# Altium schematic sheet driver_led.SchDoc
size A4; DocumentNumber: 2; SheetNumber: 2; SheetTotal: 3
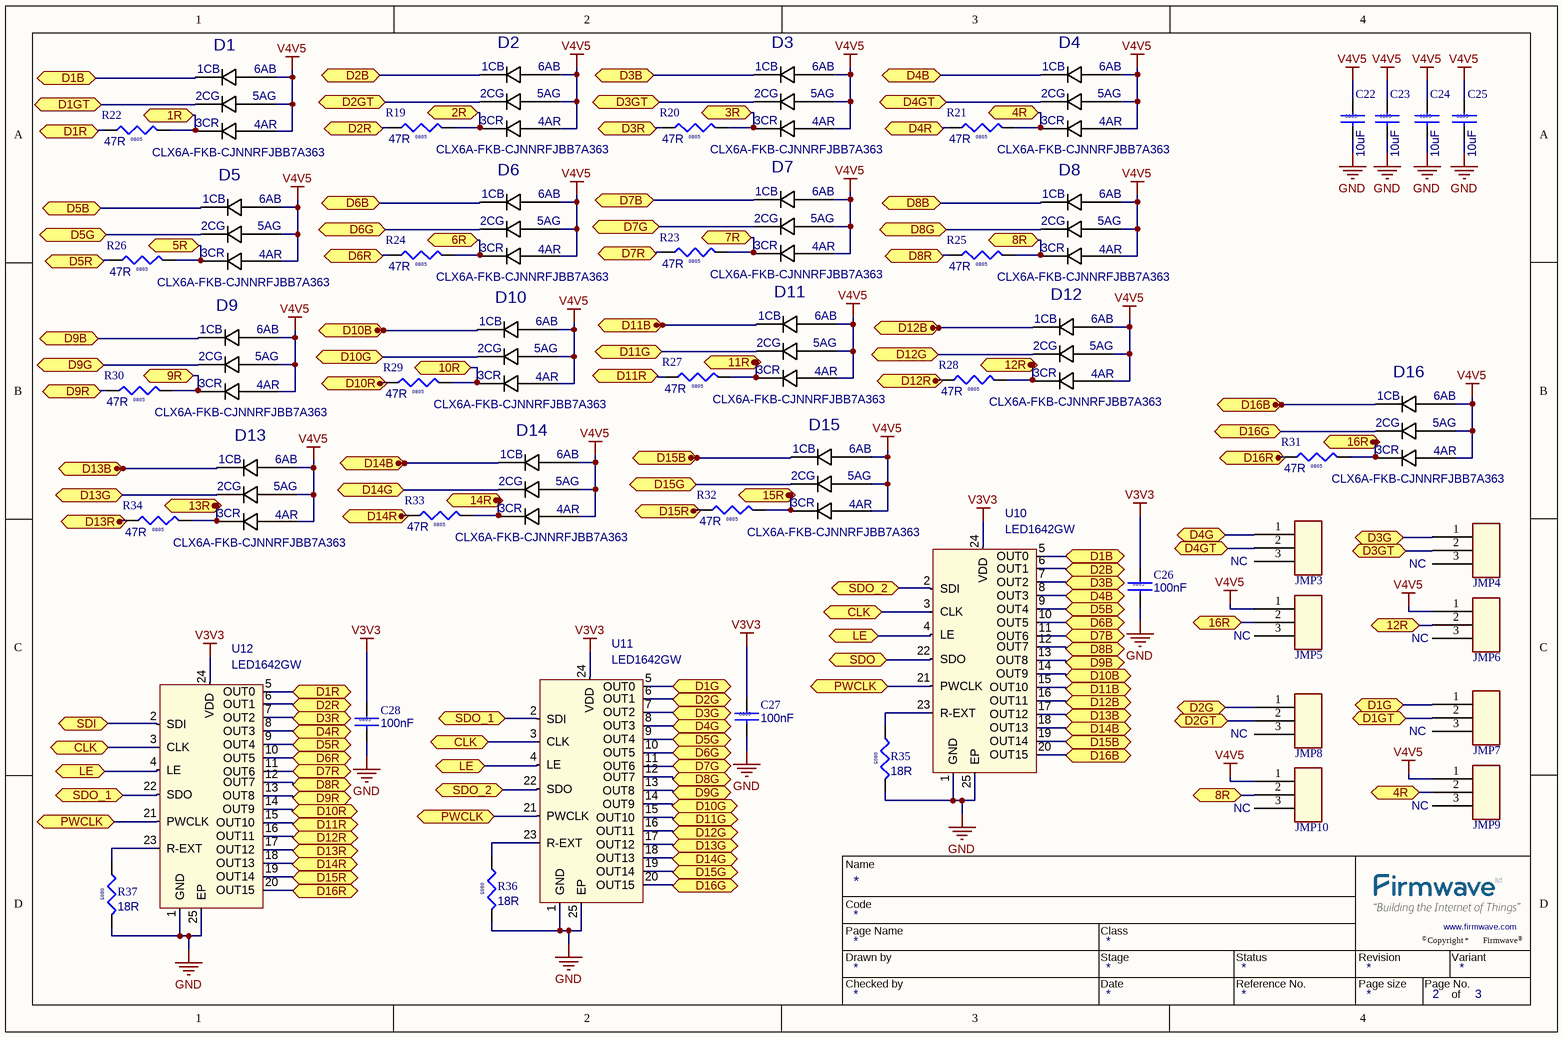
[diagram p0: driver_led.SchDoc]

## Parts
C22  value 10uF  [C0805]  (hidden comment: GRM21BR61C106KE15L)
C23  value 10uF  [C0805]  (hidden comment: GRM21BR61C106KE15L)
C24  value 10uF  [C0805]  (hidden comment: GRM21BR61C106KE15L)
C25  value 10uF  [C0805]  (hidden comment: GRM21BR61C106KE15L)
C26  value 100nF  [C0805]  (hidden comment: GRM219R71C104KA01D)
C27  value 100nF  [C0805]  (hidden comment: GRM219R71C104KA01D)
C28  value 100nF  [C0805]  (hidden comment: GRM219R71C104KA01D)
D1  CLX6A-FKB-CJNNRFJBB7A363  [SOJ100P350X290-6N]
D2  CLX6A-FKB-CJNNRFJBB7A363  [SOJ100P350X290-6N]
D3  CLX6A-FKB-CJNNRFJBB7A363  [SOJ100P350X290-6N]
D4  CLX6A-FKB-CJNNRFJBB7A363  [SOJ100P350X290-6N]
D5  CLX6A-FKB-CJNNRFJBB7A363  [SOJ100P350X290-6N]
D6  CLX6A-FKB-CJNNRFJBB7A363  [SOJ100P350X290-6N]
D7  CLX6A-FKB-CJNNRFJBB7A363  [SOJ100P350X290-6N]
D8  CLX6A-FKB-CJNNRFJBB7A363  [SOJ100P350X290-6N]
D9  CLX6A-FKB-CJNNRFJBB7A363  [SOJ100P350X290-6N]
D10  CLX6A-FKB-CJNNRFJBB7A363  [SOJ100P350X290-6N]
D11  CLX6A-FKB-CJNNRFJBB7A363  [SOJ100P350X290-6N]
D12  CLX6A-FKB-CJNNRFJBB7A363  [SOJ100P350X290-6N]
D13  CLX6A-FKB-CJNNRFJBB7A363  [SOJ100P350X290-6N]
D14  CLX6A-FKB-CJNNRFJBB7A363  [SOJ100P350X290-6N]
D15  CLX6A-FKB-CJNNRFJBB7A363  [SOJ100P350X290-6N]
D16  CLX6A-FKB-CJNNRFJBB7A363  [SOJ100P350X290-6N]
JMP3  JUMPER  [CON-HDR_3X1X254]  (value not drawn)
JMP4  JUMPER  [CON-HDR_3X1X254]  (value not drawn)
JMP5  JUMPER  [CON-HDR_3X1X254]  (value not drawn)
JMP6  JUMPER  [CON-HDR_3X1X254]  (value not drawn)
JMP7  JUMPER  [CON-HDR_3X1X254]  (value not drawn)
JMP8  JUMPER  [CON-HDR_3X1X254]  (value not drawn)
JMP9  JUMPER  [CON-HDR_3X1X254]  (value not drawn)
JMP10  JUMPER  [CON-HDR_3X1X254]  (value not drawn)
R19  value 47R  [R0805]  (hidden comment: ?)
R20  value 47R  [R0805]  (hidden comment: ?)
R21  value 47R  [R0805]  (hidden comment: ?)
R22  value 47R  [R0805]  (hidden comment: ?)
R23  value 47R  [R0805]  (hidden comment: ?)
R24  value 47R  [R0805]  (hidden comment: ?)
R25  value 47R  [R0805]  (hidden comment: ?)
R26  value 47R  [R0805]  (hidden comment: ?)
R27  value 47R  [R0805]  (hidden comment: ?)
R28  value 47R  [R0805]  (hidden comment: ?)
R29  value 47R  [R0805]  (hidden comment: ?)
R30  value 47R  [R0805]  (hidden comment: ?)
R31  value 47R  [R0805]  (hidden comment: ?)
R32  value 47R  [R0805]  (hidden comment: ?)
R33  value 47R  [R0805]  (hidden comment: ?)
R34  value 47R  [R0805]  (hidden comment: ?)
R35  value 18R  [R0805]  (hidden comment: ?)
R36  value 18R  [R0805]  (hidden comment: ?)
R37  value 18R  [R0805]  (hidden comment: ?)
U10  LED1642GW  [TSSOP-24]
U11  LED1642GW  [TSSOP-24]
U12  LED1642GW  [TSSOP-24]

## Ports
1R, 2R, 3R, 4R, 5R, 6R, 7R, 8R, 9R, 10R, 11R, 12R, 13R, 14R, 15R, 16R, CLK, D1B, D1G, D1GT, D1R, D2B, D2G, D2GT, D2R, D3B, D3G, D3GT, D3R, D4B, D4G, D4GT, D4R, D5B, D5G, D5R, D6B, D6G, D6R, D7B, D7G, D7R, D8B, D8G, D8R, D9B, D9G, D9R, D10B, D10G, D10R, D11B, D11G, D11R, D12B, D12G, D12R, D13B, D13G, D13R, D14B, D14G, D14R, D15B, D15G, D15R, D16B, D16G, D16R, LE, PWCLK, SDI, SDO, SDO_1, SDO_2

## Nets
GND: C22.2 C23.2 C24.2 C25.2 C26.2 C27.2 C28.2 R35.2 R36.2 R37.2 U10.1(GND) U10.25(EP) U11.1(GND) U11.25(EP) U12.1(GND) U12.25(EP)
V3V3: C26.1 C27.1 C28.1 U10.24(VDD) U11.24(VDD) U12.24(VDD)
V4V5: C22.1 C23.1 C24.1 C25.1 D1.4 D1.5 D1.6 D2.4 D2.5 D2.6 D3.4 D3.5 D3.6 D4.4 D4.5 D4.6 D5.4 D5.5 D5.6 D6.4 D6.5 D6.6 D7.4 D7.5 D7.6 D8.4 D8.5 D8.6 D9.4 D9.5 D9.6 D10.4 D10.5 D10.6 D11.4 D11.5 D11.6 D12.4 D12.5 D12.6 D13.4 D13.5 D13.6 D14.4 D14.5 D14.6 D15.4 D15.5 D15.6 D16.4 D16.5 D16.6 JMP5.1 JMP6.1 JMP9.1 JMP10.1
1R: D1.3 R22.2 ; port 1R
2R: D2.3 R19.2 ; port 2R
3R: D3.3 R20.2 ; port 3R
4R: D4.3 JMP9.2 R21.2 ; port 4R
5R: D5.3 R26.2 ; port 5R
6R: D6.3 R24.2 ; port 6R
7R: D7.3 R23.2 ; port 7R
8R: D8.3 JMP10.2 R25.2 ; port 8R
9R: D9.3 R30.2 ; port 9R
10R: D10.3 R29.2 ; port 10R
12R: JMP6.2 ; port 12R
16R: JMP5.2 ; port 16R
CLK: U10.3(CLK) U11.3(CLK) U12.3(CLK) ; port CLK
D1B: D1.1 U10.5(OUT0) ; port D1B
D1G: JMP7.1 U11.5(OUT0) ; port D1G
D1GT: D1.2 JMP7.2 ; port D1GT
D1R: R22.1 U12.5(OUT0) ; port D1R
D2B: D2.1 U10.6(OUT1) ; port D2B
D2G: JMP8.1 U11.6(OUT1) ; port D2G
D2GT: D2.2 JMP8.2 ; port D2GT
D2R: R19.1 U12.6(OUT1) ; port D2R
D3B: D3.1 U10.7(OUT2) ; port D3B
D3G: JMP4.1 U11.7(OUT2) ; port D3G
D3GT: D3.2 JMP4.2 ; port D3GT
D3R: R20.1 U12.7(OUT2) ; port D3R
D4B: D4.1 U10.8(OUT3) ; port D4B
D4G: JMP3.1 U11.8(OUT3) ; port D4G
D4GT: D4.2 JMP3.2 ; port D4GT
D4R: R21.1 U12.8(OUT3) ; port D4R
D5B: D5.1 U10.9(OUT4) ; port D5B
D5G: D5.2 U11.9(OUT4) ; port D5G
D5R: R26.1 U12.9(OUT4) ; port D5R
D6B: D6.1 U10.10(OUT5) ; port D6B
D6G: D6.2 U11.10(OUT5) ; port D6G
D6R: R24.1 U12.10(OUT5) ; port D6R
D7B: D7.1 U10.11(OUT6) ; port D7B
D7G: D7.2 U11.11(OUT6) ; port D7G
D7R: R23.1 U12.11(OUT6) ; port D7R
D8B: D8.1 U10.12(OUT7) ; port D8B
D8G: D8.2 U11.12(OUT7) ; port D8G
D8R: R25.1 U12.12(OUT7) ; port D8R
D9B: D9.1 U10.13(OUT8) ; port D9B
D9G: D9.2 U11.13(OUT8) ; port D9G
D9R: R30.1 U12.13(OUT8) ; port D9R
D10B: D10.1 U10.14(OUT9) ; port D10B
D10G: D10.2 U11.14(OUT9) ; port D10G
D10R: U12.14(OUT9) ; port D10R
D11B: D11.1 U10.15(OUT10) ; port D11B
D11G: D11.2 U11.15(OUT10) ; port D11G
D11R: R27.1 U12.15(OUT10) ; port D11R
D12B: D12.1 U10.16(OUT11) ; port D12B
D12G: D12.2 U11.16(OUT11) ; port D12G
D12R: U12.16(OUT11) ; port D12R
D13B: D13.1 U10.17(OUT12) ; port D13B
D13G: D13.2 U11.17(OUT12) ; port D13G
D13R: U12.17(OUT12) ; port D13R
D14B: D14.1 U10.18(OUT13) ; port D14B
D14G: D14.2 U11.18(OUT13) ; port D14G
D14R: U12.18(OUT13) ; port D14R
D15B: D15.1 U10.19(OUT14) ; port D15B
D15G: D15.2 U11.19(OUT14) ; port D15G
D15R: U12.19(OUT14) ; port D15R
D16B: D16.1 U10.20(OUT15) ; port D16B
D16G: D16.2 U11.20(OUT15) ; port D16G
D16R: U12.20(OUT15) ; port D16R
LE: U10.4(LE) U11.4(LE) U12.4(LE) ; port LE
PWCLK: U10.21(PWCLK) U11.21(PWCLK) U12.21(PWCLK) ; port PWCLK
SDI: U12.2(SDI) ; port SDI
SDO: U10.22(SDO) ; port SDO
SDO_1: U11.2(SDI) U12.22(SDO) ; port SDO_1
SDO_2: U10.2(SDI) U11.22(SDO) ; port SDO_2
NetD11_3: D11.3 R27.2
NetD12_3: D12.3 R28.2
NetD13_3: D13.3 R34.2
NetD14_3: D14.3 R33.2
NetD15_3: D15.3 R32.2
NetD16_3: D16.3 R31.2
NetR35_1: R35.1 U10.23(R-EXT)
NetR36_1: R36.1 U11.23(R-EXT)
NetR37_1: R37.1 U12.23(R-EXT)

Not connected (* = marked no-connect by the designer): JMP3 3; JMP4 3; JMP5 3; JMP6 3; JMP7 3; JMP8 3; JMP9 3; JMP10 3; R28 1; R29 1; R31 1; R32 1; R33 1; R34 1

## Notes on the sheet
- NC
- (near JMP5) NC
- (near JMP10) NC
- (near JMP9) NC
- Name
- Code
- Page Name
- Drawn by
- Checked by
- Class
- Stage
- Date
- Status
- Reference No.
- Revision
- Page size
- ©
- Page No.
- Copyright
- www.firmwave.com
- Variant
- Firmwave
- ®
- of
- (in symbol CAP0805) 0805
- (in symbol CLX6A-FKB-CJNNRFJBB7A363) 1CB; 6AB; 2CG; 5AG; 3CR; 4AR

## Library data of the parts
C22-C25 = CAP0805: Manufacturer: Murata Electronics North America; Capacitance: 10µF; Temperature Coefficient: X5R; Voltage - Rated: 16V; Tolerance: ±10%; PARTTYPE: CAP0805; Lead Spacing: -; Package / Case: 0805 (2012 Metric); Size / Dimension: 0.079" L x 0.049" W (2.00mm x 1.25mm); Thickness (Max): 0.053" (1.35mm); Height - Seated (Max): -; Mounting Type: Surface Mount, MLCC; Lead Style: -; Ratings: -; Packaging: Tape & Reel (TR); Failure Rate: *; RoHS: RoHS Compliant; Part Status: Active; Applications: General Purpose; Operating Temperature: -55°C ~ 85°C; Features: -; Manufacturer Part Number: GRM21BR61C106KE15L; Category: Capacitors; Supplier: Digi-Key; Supplier Part Number: 490-3886-2-ND
C26-C28 = CAP0805: Manufacturer: Murata Electronics North America; Tolerance: ±10%; Voltage - Rated: 16V; Capacitance: 0.10µF; Temperature Coefficient: X7R; PARTTYPE: CAP0805; Thickness (Max): 0.037" (0.95mm); Lead Spacing: -; Height - Seated (Max): -; Lead Style: -; Category: Capacitors; Size / Dimension: 0.079" L x 0.049" W (2.00mm x 1.25mm); RoHS: RoHS Compliant; Features: -; Operating Temperature: -55°C ~ 125°C; Ratings: -; Supplier: Digi-Key; Package / Case: 0805 (2012 Metric); Supplier Part Number: 490-1683-2-ND; Part Status: Active; Manufacturer Part Number: GRM219R71C104KA01D; Failure Rate: *; Packaging: Tape & Reel (TR); Mounting Type: Surface Mount, MLCC; Applications: General Purpose
D1-D16 = CLX6A-FKB-CJNNRFJBB7A363: LED Tri-Color Blue/Green/Red 470nm/527nm/630nm Automotive 6-Pin PLCC T/R; MF: Cree; pin_count: 6; viewing_angle: 120; Price: 0.47 USD; MP: CLX6A-FKB-CJNNRFJBB7A363; Availability: Good; Package: PLCC-6 Cree; Value: *; Supplier: Octopart; rohs_status: Compliant; Manufacturer Part Number: CLX6A-FKB-CJNNRFJBB7A363; Supplier Part Number: Digi-Key - CLX6A-FKB-CJNNRFJBB7A363DKR-ND; OctopartID: 3c15f42b83c4e3d2; Seller Landing  Url: https://octopart.com/click/track?country=PL&ak=8157f166&sig=0de42ae&sid=459&ppid=20224695&vpid=266981059&ct=offers; Octopart Url: http://octopart.com/clx6a-fkb-cjnnrfjbb7a363-cree-20224695; Manufacturer: Cree
JMP3-JMP10 = CON-HDR_3X1X254: PARTTYPE: CON-HDR_3X1X254
R19-R34 = RES0805: Manufacturer Part Number: ERJ-6GEYJ470V; Manufacturer: Panasonic Electronic Components; Resistance (Ohms): 47; Tolerance: ±5%; Temperature Coefficient: ±200ppm/°C; Power (Watts): 0.125W, 1/8W; PARTTYPE: RES0805; Features: Automotive AEC-Q200; Supplier Device Package: 0805; Composition: Thick Film; Supplier: Digi-Key; Height - Seated (Max): 0.028" (0.70mm); Part Status: Active; Packaging: Tape & Reel (TR); Package / Case: 0805 (2012 Metric); Operating Temperature: -55°C ~ 155°C; Size / Dimension: 0.079" L x 0.049" W (2.00mm x 1.25mm); Failure Rate: -; Number of Terminations: 2; Supplier Part Number: P47ATR-ND; Category: Resistors; RoHS: RoHS Compliant
R35-R37 = RES0805: Manufacturer: Panasonic Electronic Components; Manufacturer Part Number: ERJ-P6WF18R0V; Power (Watts): 0.5W, 1/2W; Tolerance: ±1%; Resistance (Ohms): 18; Temperature Coefficient: ±200ppm/°C; PARTTYPE: RES0805; Supplier Device Package: 0805; Height - Seated (Max): 0.030" (0.75mm); Package / Case: 0805 (2012 Metric); Number of Terminations: 2; Failure Rate: -; Size / Dimension: 0.079" L x 0.049" W (2.00mm x 1.25mm); Operating Temperature: -55°C ~ 155°C; RoHS: RoHS Compliant; Supplier Part Number: P16864TR-ND; Features: Automotive AEC-Q200, Pulse Withstanding; Packaging: Tape & Reel (TR); Part Status: Active; Category: Resistors; Composition: Thick Film; Supplier: Digi-Key
U10-U12 = LED1642GW: Manufacturer: STMicroelectronics; Manufacturer Part Number: LED1642GWPTR; Topology: Shift Register; Current - Output / Channel: 40mA; Voltage - Supply (Max): 5.5V; Internal Switch(s): Yes; Voltage - Supply (Min): 3V; Frequency: 30MHz; Number of Outputs: 16; Voltage - Output: 19V; Dimming: PWM; Supplier 1: Farnell; Supplier Part Number 1: 2460697; Package / Case: 24-SSOP (0.154", 3.90mm Width); Supplier Device Package: 24-QSOP; Applications: Signage; Type: Linear; Operating Temperature: -40°C ~ 85°C (TA); Mounting Type: Surface Mount; Category: Integrated Circuits (ICs); Supplier Part Number: 497-14028-2-ND; RoHS: RoHS Compliant; Packaging: Tape & Reel (TR); Part Status: Active; Supplier: Digi-Key